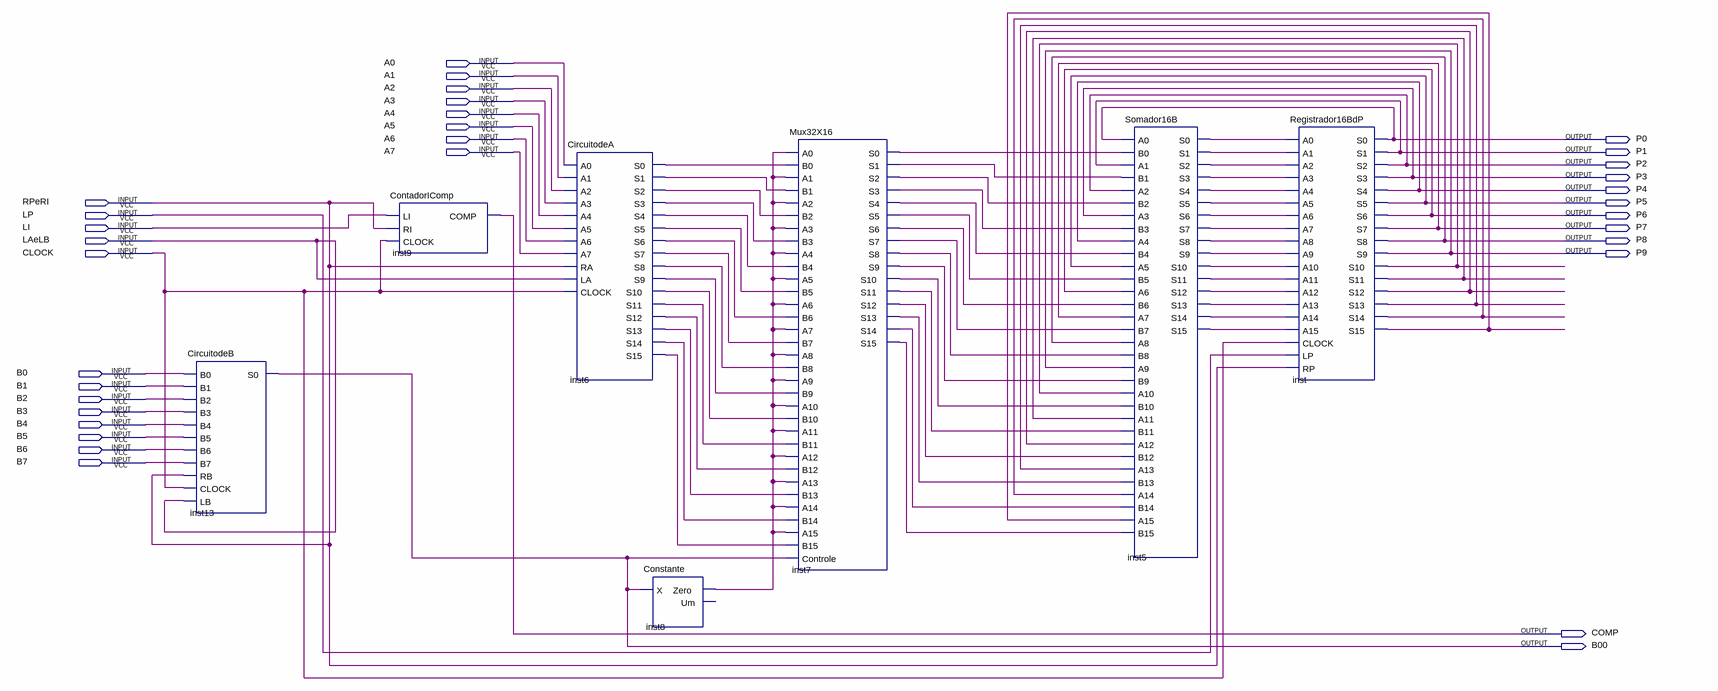
[diagram p0: schematic sheet]
// Quartus schematic Block2.bdf as structural Verilog: 7 symbols, 33 pins
module Block2 (
  input  A0,
  input  A1,
  input  A2,
  input  A3,
  input  A4,
  input  A5,
  input  A6,
  input  A7,
  input  RPeRI,
  input  LP,
  input  LI,
  input  LAeLB,
  input  CLOCK,
  input  B0,
  input  B1,
  input  B2,
  input  B3,
  input  B4,
  input  B5,
  input  B6,
  input  B7,
  output P0,
  output P1,
  output P2,
  output P3,
  output P4,
  output P5,
  output P6,
  output P7,
  output P8,
  output P9,
  output COMP,
  output B00
);

  wire inst5_s0, inst5_s1, inst5_s2, inst5_s3, inst5_s4, inst5_s5, inst5_s6, inst5_s7, inst5_s8, inst5_s9,
       inst5_s10, inst5_s11, inst5_s12, inst5_s13, inst5_s14, inst5_s15, inst6_s0, inst6_s1, inst6_s2,
       inst6_s3, inst6_s4, inst6_s5, inst6_s6, inst6_s7, inst6_s8, inst6_s9, inst6_s10, inst6_s11, inst6_s12,
       inst6_s13, inst6_s14, inst6_s15, inst7_s0, inst7_s1, inst7_s2, inst7_s3, inst7_s4, inst7_s5, inst7_s6,
       inst7_s7, inst7_s8, inst7_s9, inst7_s10, inst7_s11, inst7_s12, inst7_s13, inst7_s14, inst7_s15,
       inst8_zero, inst_s10, inst_s11, inst_s12, inst_s13, inst_s14, inst_s15;

  CircuitodeB inst13 (
    .B0(B0), .B1(B1), .B2(B2), .B3(B3), .B4(B4), .B5(B5), .B6(B6), .B7(B7), .RB(RPeRI), .CLOCK(CLOCK),
    .LB(LAeLB), .S0(B00));
  ContadorIComp inst9 (.LI(LI), .RI(RPeRI), .CLOCK(CLOCK), .COMP(COMP));
  CircuitodeA inst6 (
    .A0(A0), .A1(A1), .A2(A2), .A3(A3), .A4(A4), .A5(A5), .A6(A6), .A7(A7), .RA(RPeRI), .LA(LAeLB),
    .CLOCK(CLOCK), .S0(inst6_s0), .S1(inst6_s1), .S2(inst6_s2), .S3(inst6_s3), .S4(inst6_s4), .S5(inst6_s5),
    .S6(inst6_s6), .S7(inst6_s7), .S8(inst6_s8), .S9(inst6_s9), .S10(inst6_s10), .S11(inst6_s11),
    .S12(inst6_s12), .S13(inst6_s13), .S14(inst6_s14), .S15(inst6_s15));
  Constante inst8 (.X(B00), .Zero(inst8_zero));  // open: Um
  Mux32X16 inst7 (
    .A0(inst8_zero), .B0(inst6_s0), .A1(inst8_zero), .B1(inst6_s1), .A2(inst8_zero), .B2(inst6_s2),
    .A3(inst8_zero), .B3(inst6_s3), .A4(inst8_zero), .B4(inst6_s4), .A5(inst8_zero), .B5(inst6_s5),
    .A6(inst8_zero), .B6(inst6_s6), .A7(inst8_zero), .B7(inst6_s7), .A8(inst8_zero), .B8(inst6_s8),
    .A9(inst8_zero), .B9(inst6_s9), .A10(inst8_zero), .B10(inst6_s10), .A11(inst8_zero), .B11(inst6_s11),
    .A12(inst8_zero), .B12(inst6_s12), .A13(inst8_zero), .B13(inst6_s13), .A14(inst8_zero), .B14(inst6_s14),
    .A15(inst8_zero), .B15(inst6_s15), .Controle(B00), .S0(inst7_s0), .S1(inst7_s1), .S2(inst7_s2),
    .S3(inst7_s3), .S4(inst7_s4), .S5(inst7_s5), .S6(inst7_s6), .S7(inst7_s7), .S8(inst7_s8), .S9(inst7_s9),
    .S10(inst7_s10), .S11(inst7_s11), .S12(inst7_s12), .S13(inst7_s13), .S14(inst7_s14), .S15(inst7_s15));
  Somador16B inst5 (
    .A0(P0), .B0(inst7_s0), .A1(P1), .B1(inst7_s1), .A2(P2), .B2(inst7_s2), .A3(P3), .B3(inst7_s3), .A4(P4),
    .B4(inst7_s4), .A5(P5), .B5(inst7_s5), .A6(P6), .B6(inst7_s6), .A7(P7), .B7(inst7_s7), .A8(P8),
    .B8(inst7_s8), .A9(P9), .B9(inst7_s9), .A10(inst_s10), .B10(inst7_s10), .A11(inst_s11), .B11(inst7_s11),
    .A12(inst_s12), .B12(inst7_s12), .A13(inst_s13), .B13(inst7_s13), .A14(inst_s14), .B14(inst7_s14),
    .A15(inst_s15), .B15(inst7_s15), .S0(inst5_s0), .S1(inst5_s1), .S2(inst5_s2), .S3(inst5_s3),
    .S4(inst5_s4), .S5(inst5_s5), .S6(inst5_s6), .S7(inst5_s7), .S8(inst5_s8), .S9(inst5_s9),
    .S10(inst5_s10), .S11(inst5_s11), .S12(inst5_s12), .S13(inst5_s13), .S14(inst5_s14), .S15(inst5_s15));
  Registrador16BdP inst (
    .A0(inst5_s0), .A1(inst5_s1), .A2(inst5_s2), .A3(inst5_s3), .A4(inst5_s4), .A5(inst5_s5), .A6(inst5_s6),
    .A7(inst5_s7), .A8(inst5_s8), .A9(inst5_s9), .A10(inst5_s10), .A11(inst5_s11), .A12(inst5_s12),
    .A13(inst5_s13), .A14(inst5_s14), .A15(inst5_s15), .CLOCK(CLOCK), .LP(LP), .RP(RPeRI), .S0(P0), .S1(P1),
    .S2(P2), .S3(P3), .S4(P4), .S5(P5), .S6(P6), .S7(P7), .S8(P8), .S9(P9), .S10(inst_s10), .S11(inst_s11),
    .S12(inst_s12), .S13(inst_s13), .S14(inst_s14), .S15(inst_s15));
endmodule
